# EAGLE design 477part (EAGLE 9.5.1)
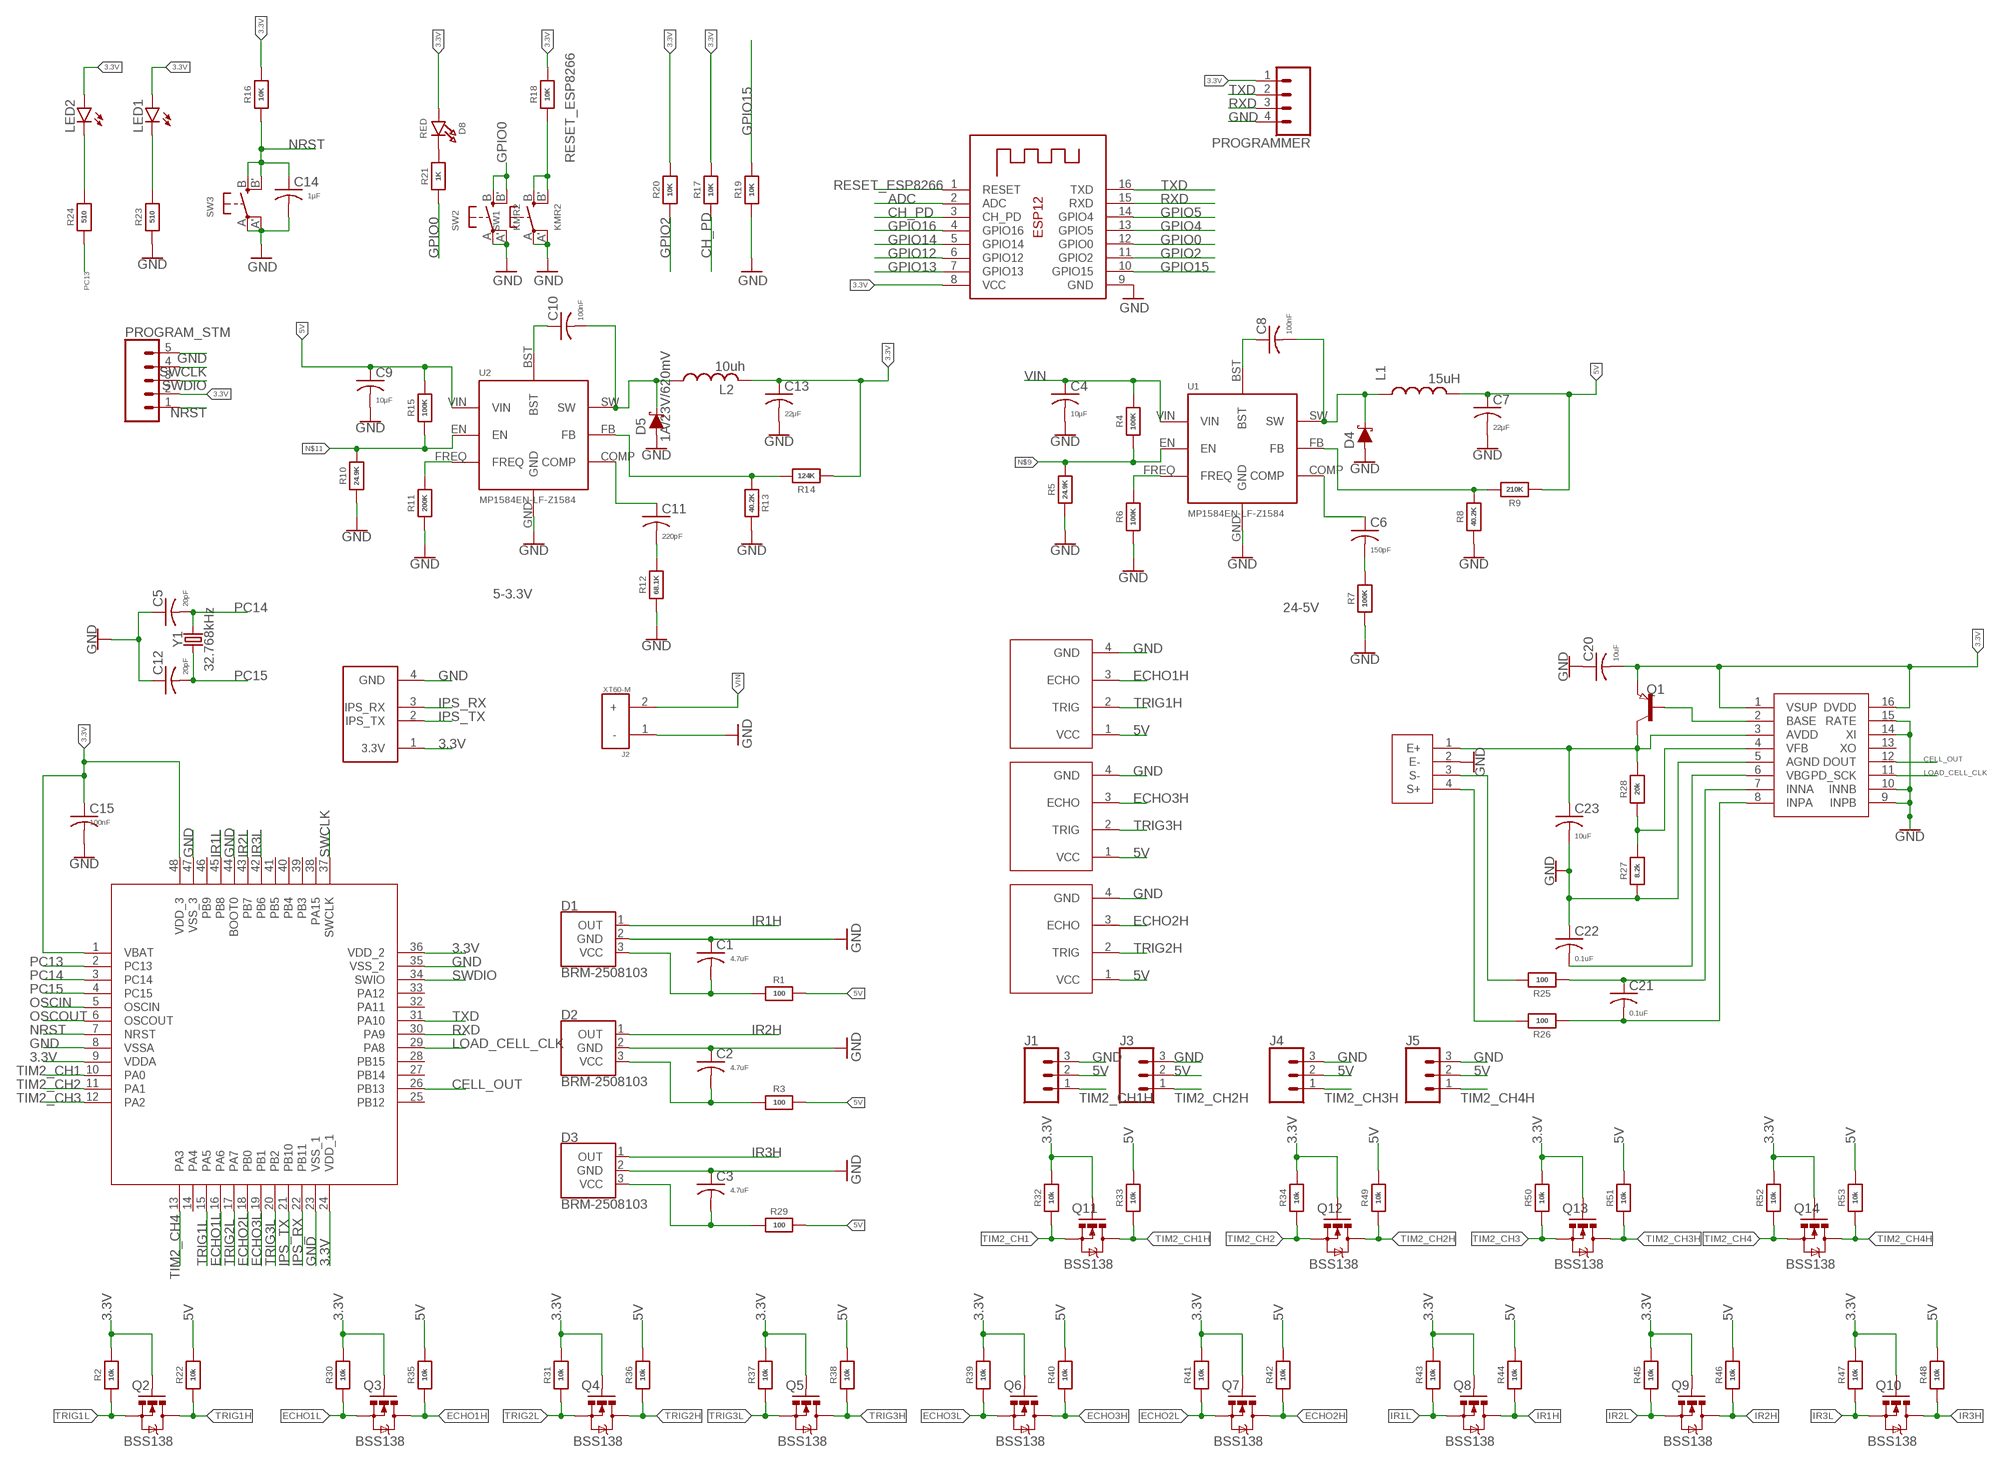
[diagram p0: schematic, sheet 1]

## Parts
C1  4.7uF  C-USC0603  [C0603]
C2  4.7uF  C-USC0603  [C0603]
C3  4.7uF  C-USC0603  [C0603]
C4  10μF  C-USC0603  [C0603]
C5  20pF  C-USC0603  [C0603]
C6  150pF  C-USC0603  [C0603]
C7  22μF  C-USC0603  [C0603]
C8  100nF  C-USC0603  [C0603]
C9  10μF  C-USC0603  [C0603]
C10  100nF  C-USC0603  [C0603]
C11  220pF  C-USC0603  [C0603]
C12  20pF  C-USC0603  [C0603]
C13  22μF  C-USC0603  [C0603]
C14  1µF  C-USC0603  [C0603]
C15  100nF  C-USC0603  [C0603]
C20  10uF  C-USC0603  [C0603]
C21  0.1uF  C-USC0603  [C0603]
C22  0.1uF  C-USC0603  [C0603]
C23  10uF  C-USC0603  [C0603]
D1  BRM-2508103  [1X03]
D2  BRM-2508103  [1X03]
D3  BRM-2508103  [1X03]
D4  1A/23V/620mV  DIODE-SCHOTTKY-BAT20J  [SOD-323]
D5  1A/23V/620mV  DIODE-SCHOTTKY-BAT20J  [SOD-323]
D8  RED  LED0805_NOOUTLINE  [CHIPLED_0805_NOOUTLINE]
ESP8266  ESP-8266  ESP-12  [ESP-12]
HC_SR04_1  ULTRA_4  [1X04]
HC_SR04_2  ULTRA_4  [1X04]
HC_SR04_3  ULTRA_4  [1X04]
J1  CONN_03  [1X03]
J2  XT60-M  [AMASS_XT60-M]
J3  CONN_03  [1X03]
J4  CONN_03  [1X03]
J5  CONN_03  [1X03]
L1  15uH  INDUCTOR2  [INDUCTOR2]
L2  10uh  INDUCTOR  [INDUCTOR]
LED1  LEDCHIP-LED0603  [CHIP-LED0603]
LED2  LEDCHIP-LED0603  [CHIP-LED0603]
PROGRAM_STM  CONN_05  [1X05]
PROGRAMMER  CONN_04  [1X04]
Q1  PNP-TRANSISTOR_SOT23  [SOT23]
Q2  BSS138  MOSFET-NCHANNELSMD  [SOT23-3]
Q3  BSS138  MOSFET-NCHANNELSMD  [SOT23-3]
Q4  BSS138  MOSFET-NCHANNELSMD  [SOT23-3]
Q5  BSS138  MOSFET-NCHANNELSMD  [SOT23-3]
Q6  BSS138  MOSFET-NCHANNELSMD  [SOT23-3]
Q7  BSS138  MOSFET-NCHANNELSMD  [SOT23-3]
Q8  BSS138  MOSFET-NCHANNELSMD  [SOT23-3]
Q9  BSS138  MOSFET-NCHANNELSMD  [SOT23-3]
Q10  BSS138  MOSFET-NCHANNELSMD  [SOT23-3]
Q11  BSS138  MOSFET-NCHANNELSMD  [SOT23-3]
Q12  BSS138  MOSFET-NCHANNELSMD  [SOT23-3]
Q13  BSS138  MOSFET-NCHANNELSMD  [SOT23-3]
Q14  BSS138  MOSFET-NCHANNELSMD  [SOT23-3]
R1  100  RESISTOR0805_NOOUTLINE  [0805-NO]
R2  10k  RESISTOR0805_NOOUTLINE  [0805-NO]
R3  100  RESISTOR0805_NOOUTLINE  [0805-NO]
R4  100K  RESISTOR0805_NOOUTLINE  [0805-NO]
R5  24.9K  RESISTOR0805_NOOUTLINE  [0805-NO]
R6  100K  RESISTOR0805_NOOUTLINE  [0805-NO]
R7  100K  RESISTOR0805_NOOUTLINE  [0805-NO]
R8  40.2K  RESISTOR0805_NOOUTLINE  [0805-NO]
R9  210K  RESISTOR0805_NOOUTLINE  [0805-NO]
R10  24.9K  RESISTOR0805_NOOUTLINE  [0805-NO]
R11  200K  RESISTOR0805_NOOUTLINE  [0805-NO]
R12  68.1K  RESISTOR0805_NOOUTLINE  [0805-NO]
R13  40.2K  RESISTOR0805_NOOUTLINE  [0805-NO]
R14  124K  RESISTOR0805_NOOUTLINE  [0805-NO]
R15  100K  RESISTOR0805_NOOUTLINE  [0805-NO]
R16  10K  RESISTOR0805_NOOUTLINE  [0805-NO]
R17  10K  RESISTOR0805_NOOUTLINE  [0805-NO]
R18  10K  RESISTOR0805_NOOUTLINE  [0805-NO]
R19  10K  RESISTOR0805_NOOUTLINE  [0805-NO]
R20  10K  RESISTOR0805_NOOUTLINE  [0805-NO]
R21  1K  RESISTOR0805_NOOUTLINE  [0805-NO]
R22  10k  RESISTOR0805_NOOUTLINE  [0805-NO]
R23  510  RESISTOR0805_NOOUTLINE  [0805-NO]
R24  510  RESISTOR0805_NOOUTLINE  [0805-NO]
R25  100  RESISTOR0805_NOOUTLINE  [0805-NO]
R26  100  RESISTOR0805_NOOUTLINE  [0805-NO]
R27  8.2k  RESISTOR0805_NOOUTLINE  [0805-NO]
R28  20k  RESISTOR0805_NOOUTLINE  [0805-NO]
R29  100  RESISTOR0805_NOOUTLINE  [0805-NO]
R30  10k  RESISTOR0805_NOOUTLINE  [0805-NO]
R31  10k  RESISTOR0805_NOOUTLINE  [0805-NO]
R32  10k  RESISTOR0805_NOOUTLINE  [0805-NO]
R33  10k  RESISTOR0805_NOOUTLINE  [0805-NO]
R34  10k  RESISTOR0805_NOOUTLINE  [0805-NO]
R35  10k  RESISTOR0805_NOOUTLINE  [0805-NO]
R36  10k  RESISTOR0805_NOOUTLINE  [0805-NO]
R37  10k  RESISTOR0805_NOOUTLINE  [0805-NO]
R38  10k  RESISTOR0805_NOOUTLINE  [0805-NO]
R39  10k  RESISTOR0805_NOOUTLINE  [0805-NO]
R40  10k  RESISTOR0805_NOOUTLINE  [0805-NO]
R41  10k  RESISTOR0805_NOOUTLINE  [0805-NO]
R42  10k  RESISTOR0805_NOOUTLINE  [0805-NO]
R43  10k  RESISTOR0805_NOOUTLINE  [0805-NO]
R44  10k  RESISTOR0805_NOOUTLINE  [0805-NO]
R45  10k  RESISTOR0805_NOOUTLINE  [0805-NO]
R46  10k  RESISTOR0805_NOOUTLINE  [0805-NO]
R47  10k  RESISTOR0805_NOOUTLINE  [0805-NO]
R48  10k  RESISTOR0805_NOOUTLINE  [0805-NO]
R49  10k  RESISTOR0805_NOOUTLINE  [0805-NO]
R50  10k  RESISTOR0805_NOOUTLINE  [0805-NO]
R51  10k  RESISTOR0805_NOOUTLINE  [0805-NO]
R52  10k  RESISTOR0805_NOOUTLINE  [0805-NO]
R53  10k  RESISTOR0805_NOOUTLINE  [0805-NO]
STM32F1  STM32F1LQFP48  [LQFP-48]
SW1  KMR2  SWITCH_TACT_SMT4.6X2.8  [BTN_KMR2_4.6X2.8]
SW2  KMR2  SWITCH_TACT_SMT4.6X2.8  [BTN_KMR2_4.6X2.8]
SW3  KMR2  SWITCH_TACT_SMT4.6X2.8  [BTN_KMR2_4.6X2.8]
U1  MP1584EN-LF-Z1584  [MP1584_V2]
U2  MP1584EN-LF-Z1584  [MP1584_V2]
U$1  IPS_G4  [1X04]
U$9  FSR_SR  [1X04]
U$10  HX711  [SO16A]
Y1  32.768kHz  CRYSTAL-32.768KHZSMD-3.2X1.5  [CRYSTAL-SMD-3.2X1.5MM]

## Nets
3.3V: C13.1 C15.1 C20.2 D8.A ESP8266.8(VCC) L2.P$2 LED1.A LED2.A PROGRAM_STM.2 PROGRAMMER.1 Q1.2(E) Q2.1(G) Q3.1(G) Q4.1(G) Q5.1(G) Q6.1(G) Q7.1(G) Q8.1(G) Q9.1(G) Q10.1(G) Q11.1(G) Q12.1(G) Q13.1(G) Q14.1(G) R2.2 R14.1 R16.2 R17.2 R18.2 R20.2 R30.2 R31.2 R32.2 R34.2 R37.2 R39.2 R41.2 R43.2 R45.2 R47.2 R50.2 R52.2 STM32F1.1(VBAT) STM32F1.9(VDDA) STM32F1.24(VDD_1) STM32F1.36(VDD_2) STM32F1.48(VDD_3) U$1.1(3.3V) U$10.1(VSUP) U$10.16(DVDD)
5V: C7.1 C9.1 HC_SR04_1.1(VCC) HC_SR04_2.1(VCC) HC_SR04_3.1(VCC) J1.2 J3.2 J4.2 J5.2 L1.P$2 R1.2 R3.2 R9.1 R15.2 R22.2 R29.2 R33.2 R35.2 R36.2 R38.2 R40.2 R42.2 R44.2 R46.2 R48.2 R49.2 R51.2 R53.2 U2.VIN
ADC: ESP8266.2(ADC)
BASE: Q1.1(B) U$10.2(BASE)
BST: C8.1 U1.BST
BST@2: C10.1 U2.BST
CELL_OUT [sig]: STM32F1.26(PB13) U$10.12(DOUT)
CH_PD: ESP8266.3(CH_PD) R17.1
COMP: C6.1 U1.COMP
COMP@2: C11.1 U2.COMP
ECHO1H [sig]: HC_SR04_1.3(ECHO) Q3.3(D) R35.1
ECHO1L [sig]: Q3.2(S) R30.1 STM32F1.16(PA6)
ECHO2H [sig]: HC_SR04_3.3(ECHO) Q7.3(D) R42.1
ECHO2L [sig]: Q7.2(S) R41.1 STM32F1.18(PB0)
ECHO3H [sig]: HC_SR04_2.3(ECHO) Q6.3(D) R40.1
ECHO3L [sig]: Q6.2(S) R39.1 STM32F1.19(PB1)
FB: R8.2 R9.2 U1.FB
FB@2: R13.1 R14.2 U2.FB
FREQ: R6.2 U1.FREQ
FREQ@2: R11.2 U2.FREQ
GND: C1.1 C2.1 C3.1 C4.2 C5.1 C7.2 C9.2 C12.1 C13.2 C14.2 C15.2 C20.1 C22.1 C23.2 D1.2(GND) D2.2(GND) D3.2(GND) D4.A D5.A ESP8266.9(GND) HC_SR04_1.4(GND) HC_SR04_2.4(GND) HC_SR04_3.4(GND) J1.3 J2.1(-) J3.3 J4.3 J5.3 PROGRAM_STM.5 PROGRAMMER.4 R5.1 R6.1 R7.1 R8.1 R10.1 R11.1 R12.1 R13.2 R19.1 R23.1 R27.1 STM32F1.8(VSSA) STM32F1.23(VSS_1) STM32F1.35(VSS_2) STM32F1.44(BOOT0) STM32F1.47(VSS_3) SW1.A'(P1) SW1.A(P) SW2.A'(P1) SW2.A(P) SW3.A'(P1) SW3.A(P) U1.GND U2.GND U$1.4(GND) U$9.2(E-) U$10.5(AGND) U$10.9(INPB) U$10.10(INNB) U$10.14(XI) U$10.15(RATE)
GPIO0: ESP8266.12(GPIO0) R21.1 SW2.B'(S1) SW2.B(S)
GPIO2: ESP8266.11(GPIO2) R20.1
GPIO4: ESP8266.13(GPIO5)
GPIO5: ESP8266.14(GPIO4)
GPIO12: ESP8266.6(GPIO12)
GPIO13: ESP8266.7(GPIO13)
GPIO14: ESP8266.5(GPIO14)
GPIO15: ESP8266.10(GPIO15) R19.2
GPIO16: ESP8266.4(GPIO16)
INNA: C21.1 R25.1 U$10.7(INNA)
INPA: C21.2 R26.1 U$10.8(INPA)
IPS_RX [sig]: STM32F1.22(PB11) U$1.3(IPS_RX)
IPS_TX [sig]: STM32F1.21(PB10) U$1.2(IPS_TX)
IR1H: D1.1(OUT) Q8.3(D) R44.1
IR1L: Q8.2(S) R43.1 STM32F1.45(PB8)
IR2H: D2.1(OUT) Q9.3(D) R46.1
IR2L: Q9.2(S) R45.1 STM32F1.43(PB7)
IR3H: D3.1(OUT) Q10.3(D) R48.1
IR3L: Q10.2(S) R47.1 STM32F1.42(PB6)
LOAD_CELL_CLK [sig]: STM32F1.29(PA8) U$10.11(PD_SCK)
N$1: C1.2 D1.3(VCC) R1.1
N$2: C2.2 D2.3(VCC) R3.1
N$3: C11.2 R12.2
N$4: LED2.C R24.2
N$5: C3.2 D3.3(VCC) R29.1
N$6: D8.C R21.2
N$7: R27.2 R28.1 U$10.4(VFB)
N$8: LED1.C R23.2
N$9 [vcc]: R4.1 R5.2 U1.EN
N$10: C6.2 R7.2
N$11: R10.2 R15.1 U2.EN
N$14: C22.2 U$10.6(VBG)
NRST: C14.1 PROGRAM_STM.1 R16.1 STM32F1.7(NRST) SW3.B'(S1) SW3.B(S)
OSCIN: STM32F1.5(OSCIN)
OSCOUT: STM32F1.6(OSCOUT)
PC13: R24.1 STM32F1.2(PC13)
PC14: C5.2 STM32F1.3(PC14) Y1.P$2
PC15: C12.2 STM32F1.4(PC15) Y1.P$1
RESET_ESP8266 [sig]: ESP8266.1(RESET) R18.1 SW1.B'(S1) SW1.B(S)
RXD [sig]: ESP8266.15(RXD) PROGRAMMER.3 STM32F1.30(PA9)
S+: R26.2 U$9.4(S+)
S-: R25.2 U$9.3(S-)
SW [sig]: C8.2 D4.C L1.P$1 U1.SW
SW@2: C10.2 D5.C L2.P$1 U2.SW
SWCLK [sig]: PROGRAM_STM.4 STM32F1.37(SWCLK)
SWDIO [sig]: PROGRAM_STM.3 STM32F1.34(SWIO)
TIM2_CH1: Q11.2(S) R32.1 STM32F1.10(PA0)
TIM2_CH1H: J1.1 Q11.3(D) R33.1
TIM2_CH2: Q12.2(S) R34.1 STM32F1.11(PA1)
TIM2_CH2H: J3.1 Q12.3(D) R49.1
TIM2_CH3: Q13.2(S) R50.1 STM32F1.12(PA2)
TIM2_CH3H: J4.1 Q13.3(D) R51.1
TIM2_CH4: Q14.2(S) R52.1 STM32F1.13(PA3)
TIM2_CH4H: J5.1 Q14.3(D) R53.1
TRIG1H: HC_SR04_1.2(TRIG) Q2.3(D) R22.1
TRIG1L: Q2.2(S) R2.1 STM32F1.15(PA5)
TRIG2H [sig]: HC_SR04_3.2(TRIG) Q4.3(D) R36.1
TRIG2L [sig]: Q4.2(S) R31.1 STM32F1.17(PA7)
TRIG3H [sig]: HC_SR04_2.2(TRIG) Q5.3(D) R38.1
TRIG3L [sig]: Q5.2(S) R37.1 STM32F1.20(PB2)
TXD [sig]: ESP8266.16(TXD) PROGRAMMER.2 STM32F1.31(PA10)
VFB: C23.1 Q1.3(C) R28.2 U$9.1(E+) U$10.3(AVDD)
VIN: C4.1 J2.2(+) R4.2 U1.VIN
Unconnected: STM32F1.14(PA4) STM32F1.25(PB12) STM32F1.27(PB14) STM32F1.28(PB15) STM32F1.32(PA11) STM32F1.33(PA12) STM32F1.38(PA15) STM32F1.39(PB3) STM32F1.40(PB4) STM32F1.41(PB5) STM32F1.46(PB9) U$10.13(XO)

## Notes on the sheet
- 5-3.3V
- 24-5V

## Library data of the parts
C1-C15 C20-C23 = adafruit:C-US: CAPACITOR, American symbol
D1-D3 = BRM-2508:BRM-2508: BRM-2508 IR Receiver Module 2.7V/5.5V IR Receiver with Low Power Consumption, High-immunity Against Ambient Light. Example Datasheet <http://www.sinoskysun.com/upload/20110512/201105120447164615.PDF>
D4 D5 = SparkFun-DiscreteSemi:DIODE-SCHOTTKY: Schottky diode A Schottky diode is a semiconductor diode which has a low forward voltage drop and a very fast switching action.; PROD_ID: DIO-11623
D8 = microbuilder:LED: LED
ESP8266 = microbuilder:ESP-12
HC_SR04_1-HC_SR04_3 = 477pcb:ULTRA_4
J1 J3-J5 = SparkFun-Connectors:CONN_03: Multi connection point. Often used as Generic Header-pin footprint for 0.1 inch spaced/style header connections On any of the 0.1 inch spaced packages, you can populate with these: Break Away Headers - Straight <https://www.sparkfun.com/products/116> (PRT-00116) Break Away Male Headers - Right Angle <https://www.sparkfun.com/products/553> (PRT-00553) Female Headers <https://www.sparkfun.com/products/115> (PRT-00115) Break Away Headers - Machine Pin <https://www.sparkfun.com/products/117> (PRT-00117) Break Away Female Headers - Swiss Machine Pin <https://www.sparkfun.com/products/743> (PRT-00743) Stackable Header - 3 Pin (Female, 0.1") <https://www.sparkfun.com/products/13875> (PRT-13875) For SCREWTERMINALS and SPRING TERMINALS visit here: Screw Terimnals on SparkFun.com <https://www.sparkfun.com/search/results?term=Screw+Terminals> (5mm/3.5mm/2.54mm spacing) This device is also useful as a general connection point to wire up your design to another part of your project. Our various solder wires solder well into these plated through hole pads. Hook-Up Wire - Assortment (Stranded, 22 AWG) <https://www.sparkfun.com/products/11375> (PRT-11375) Hook-Up Wire - Assortment (Solid Core, 22 AWG) <https://www.sparkfun.com/products/11367> (PRT-11367) View the entire wire category on our website here <https://www.sparkfun.com/categories/141> Special notes: Molex polarized connector foot print use with SKU : PRT-08232 with associated crimp pins and housings.
J2 = XT60-M:XT60-M: DC supply; XT60; male; PIN:2; for cable; soldered; 60A; 500V; AVAILABILITY: Unavailable; MF: AMASS; MP: XT60-M; PACKAGE: Package Analog Devices; PRICE: None
L1 = 477pcb:INDUCTOR2
L2 = 477pcb:INDUCTOR
LED1 LED2 = led:LED: LED
PROGRAM_STM = 477pcb:CONN_05: Multi connection point. Often used as Generic Header-pin footprint for 0.1 inch spaced/style header connections On any of the 0.1 inch spaced packages, you can populate with these: Break Away Headers - Straight <https://www.sparkfun.com/products/116> (PRT-00116) Break Away Male Headers - Right Angle <https://www.sparkfun.com/products/553> (PRT-00553) Female Headers <https://www.sparkfun.com/products/115> (PRT-00115) Break Away Headers - Machine Pin <https://www.sparkfun.com/products/117> (PRT-00117) Break Away Female Headers - Swiss Machine Pin <https://www.sparkfun.com/products/743> (PRT-00743) For SCREWTERMINALS and SPRING TERMINALS visit here: Screw Terimnals on SparkFun.com <https://www.sparkfun.com/search/results?term=Screw+Terminals> (5mm/3.5mm/2.54mm spacing) This device is also useful as a general connection point to wire up your design to another part of your project. Our various solder wires solder well into these plated through hole pads. Hook-Up Wire - Assortment (Stranded, 22 AWG) <https://www.sparkfun.com/products/11375> (PRT-11375) Hook-Up Wire - Assortment (Solid Core, 22 AWG) <https://www.sparkfun.com/products/11367> (PRT-11367) View the entire wire category on our website here <https://www.sparkfun.com/categories/141> Special notes: Molex polarized connector foot print use with SKU : PRT-08231 with associated crimp pins and housings. 1MM SMD Version SKU: PRT-10208
PROGRAMMER = SparkFun-Connectors:CONN_04: Multi connection point. Often used as Generic Header-pin footprint for 0.1 inch spaced/style header connections On any of the 0.1 inch spaced packages, you can populate with these: Break Away Headers - Straight <https://www.sparkfun.com/products/116> (PRT-00116) Break Away Male Headers - Right Angle <https://www.sparkfun.com/products/553> (PRT-00553) Female Headers <https://www.sparkfun.com/products/115> (PRT-00115) Break Away Headers - Machine Pin <https://www.sparkfun.com/products/117> (PRT-00117) Break Away Female Headers - Swiss Machine Pin <https://www.sparkfun.com/products/743> (PRT-00743) For SCREWTERMINALS and SPRING TERMINALS visit here: Screw Terimnals on SparkFun.com <https://www.sparkfun.com/search/results?term=Screw+Terminals> (5mm/3.5mm/2.54mm spacing) This device is also useful as a general connection point to wire up your design to another part of your project. Our various solder wires solder well into these plated through hole pads. Hook-Up Wire - Assortment (Stranded, 22 AWG) <https://www.sparkfun.com/products/11375> (PRT-11375) Hook-Up Wire - Assortment (Solid Core, 22 AWG) <https://www.sparkfun.com/products/11367> (PRT-11367) View the entire wire category on our website here <https://www.sparkfun.com/categories/141> Special notes: Molex polarized connector foot print use with SKU : PRT-08231 with associated crimp pins and housings. 1MM SMD Version SKU: PRT-10208; PROD_ID: CONN-09696
Q1 = semicon-smd-ipc:PNP-TRANSISTOR_: PNP TRANSISTOR
Q2-Q14 = SparkFun:MOSFET-NCHANNEL
R1-R53 = microbuilder:RESISTOR: Resistors For new designs, use the packages preceded by an '_' character since they are more reliable: The following footprints should be used on most boards: _0402 - Standard footprint for regular board layouts _0603 - Standard footprint for regular board layouts _0805 - Standard footprint for regular board layouts _1206 - Standard footprint for regular board layouts For extremely tight-pitch boards where space is at a premium, the following 'micro-pitch' footprints can be used (smaller pads, no silkscreen outline, etc.): _0402MP - Micro-pitch footprint for very dense/compact boards _0603MP - Micro-pitch footprint for very dense/compact boards _0805MP - Micro-pitch footprint for very dense/compact boards _1206MP - Micro-pitch footprint for very dense/compact boards
STM32F1 = 477pcb:STM32F1
SW1-SW3 = microbuilder:SWITCH_TACT_SMT: SMT Tact Switches 6x6mm - Digikey: P12940SCT-ND KMR2 (4.6x2.8mm) - Digikey: 401-1426-1-ND EVQ-PQHB55 - Light Touch, 160GF (4.5x4.5mm) - Digikey: P8090SCT-ND KMT0 - KMT021 NGJ LHS (etc.) IP68/Waterproof - Digikey: CKN10289CT-ND
U1 U2 = MP1584EN-LF-Z:MP1584EN-LF-Z: The MP1584 is a high frequency step-down switching regulator with an integrated internal high-side high voltage power MOSFET. It provides 3A output with current mode control for fast loop response and easy compensation. The wide 4.5V to 28V input range accommodates a variety of step-down applications, including those in an automotive input environment. A 100µA operational quiescent current allows use in battery-powered applications.
U$1 = 477pcb:IPS_G
U$9 = 477pcb:FSR_SR
U$10 = 477pcb:HX711
Y1 = SparkFun-Clocks:CRYSTAL-32.768KHZ: 32.768kHz Crystal Frequency: 32.768kHz Frequency Stability: ±20ppm Load Capacitance: 12.5pF (PTH-2X6 & SMD-3.2X1.5), 6pF (SMD-2X6) SparkFun Products: SparkFun BigTime Watch Kit <https://www.sparkfun.com/products/11734> SparkFun nRF52832 Breakout <https://www.sparkfun.com/products/13990> SparkFun Real Time Clock Module <https://www.sparkfun.com/products/12708>; PROD_ID: XTAL-13062

## Net classes
0 default: width 0.152 mm, drill 0.305 mm, clearance 0.254 mm
1 sig: width 0.152 mm, drill 0.305 mm, clearance 0.254 mm
2 vcc: width 0.328 mm, drill 0.305 mm, clearance 0.254 mm

## Board
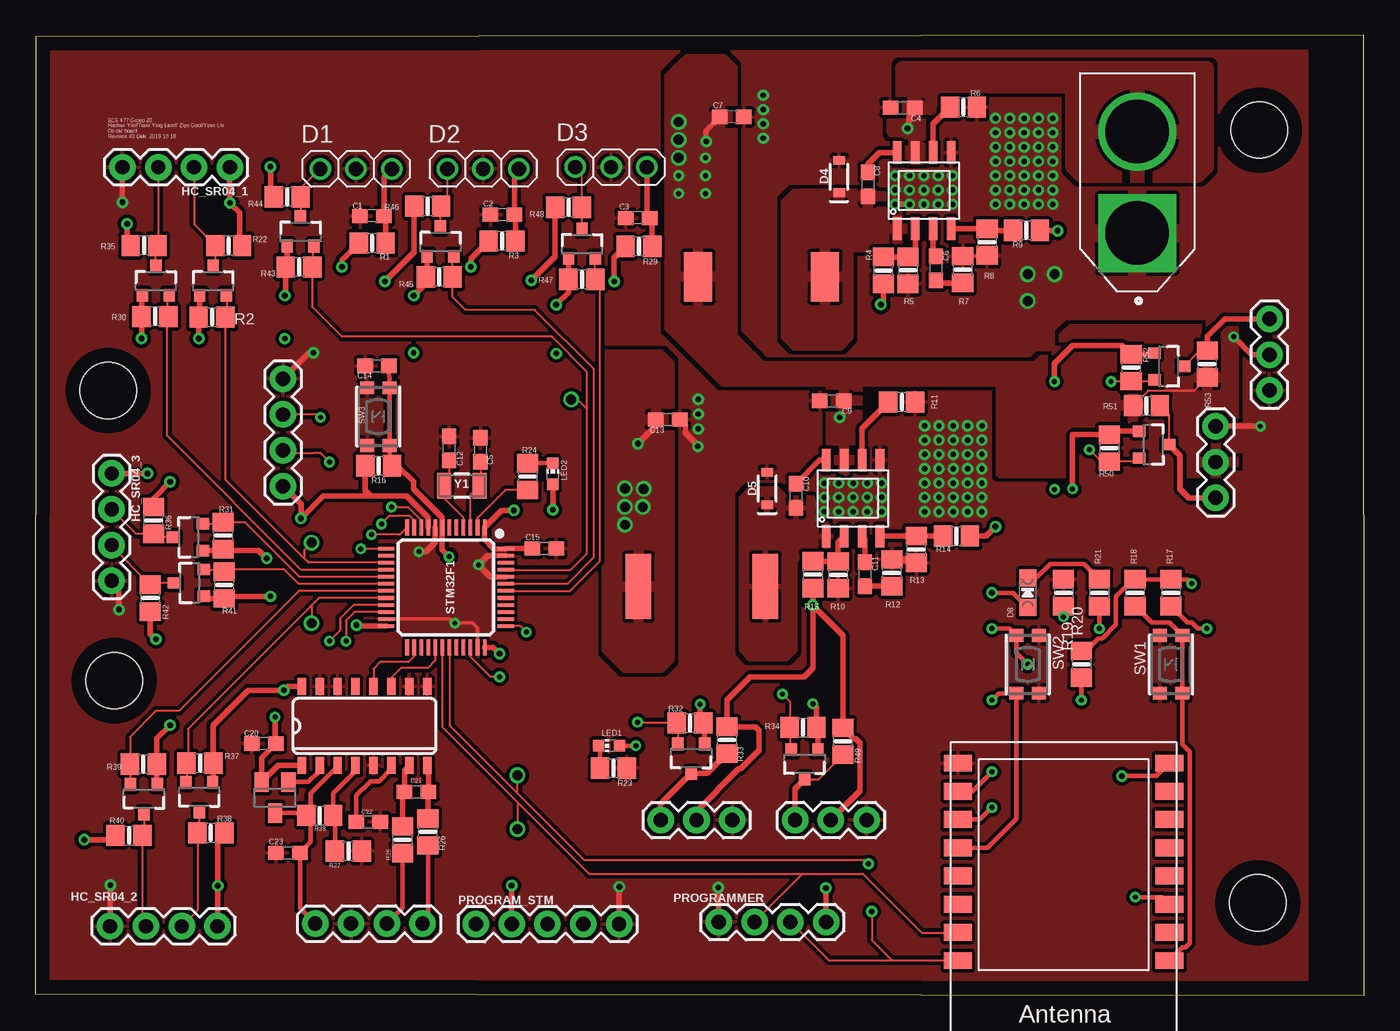
[diagram p1: board, top side]
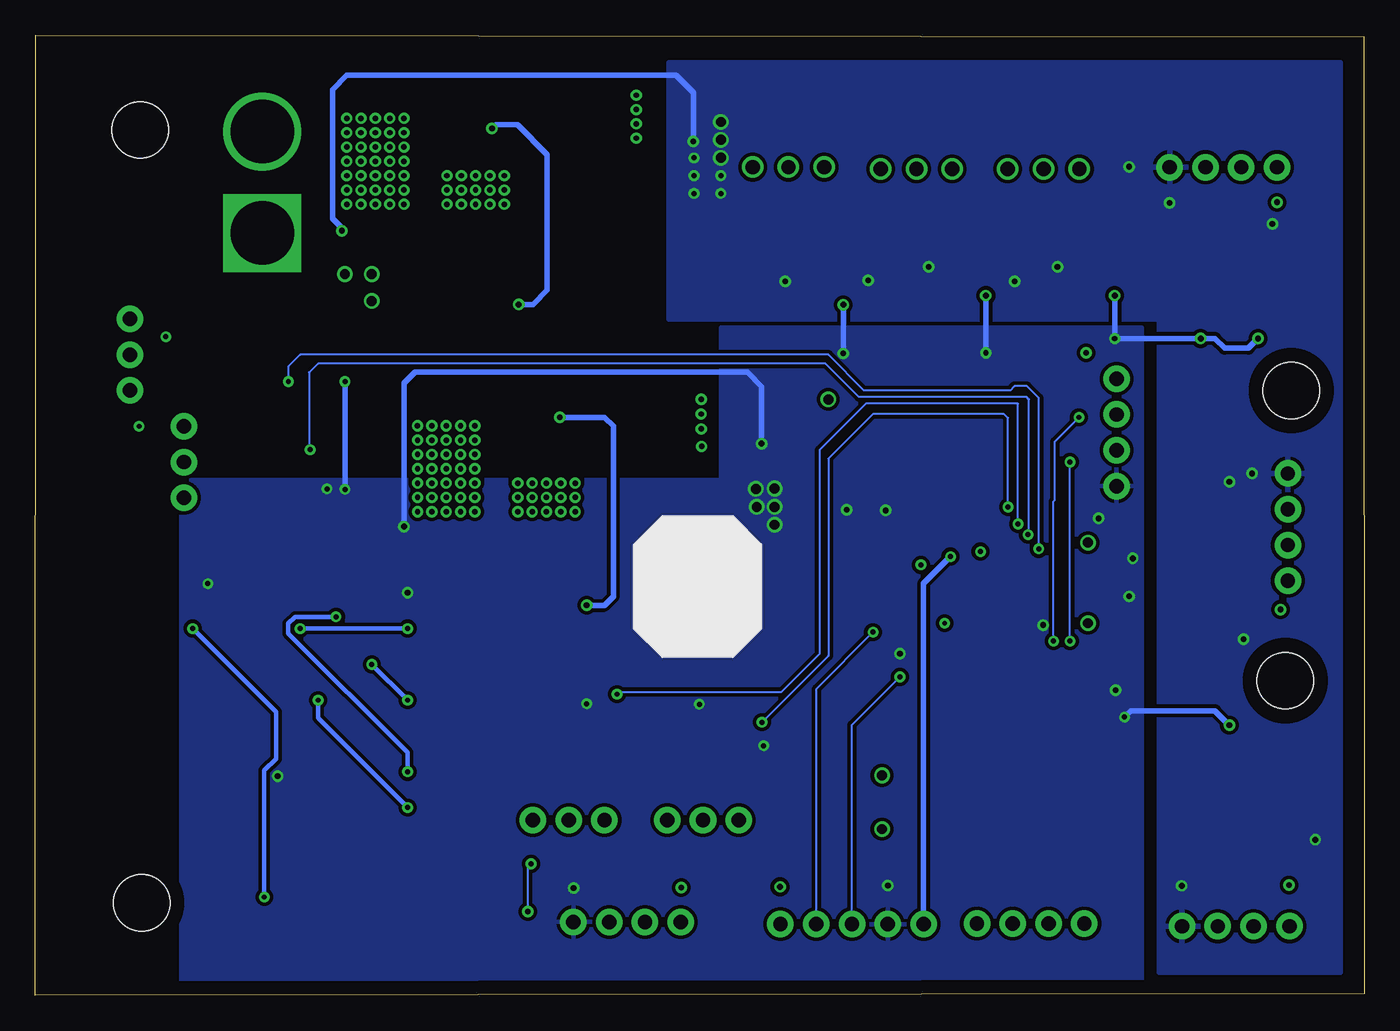
[diagram p2: board, bottom side, seen from below]

Size 94.28 x 68.11 mm. Coordinates in mm from the lower left corner, seen from the top.
Outline: 0,0.11 94.28,0 94.23,68.11 0.03,68.01 0,0.11
Copper layers (1*16): Top 0.035mm / dielectric 1.5mm / Bottom 0.035mm
Design rules "default": minimum track width 6mil, minimum drill 0.35mm, track to track 6mil, track to pad 6mil, pad to pad 6mil, via to via 6mil, smd to smd 6mil, copper to edge 40mil, drill to drill 6mil, minimum pad ring 10mil, minimum via ring 8mil, stop-mask expansion 4mil, vias tented up to drill 0mil, thermal gap 10mil
Holes 4 mm at 86.72,6.57 5.6,22.32 5.17,42.9 86.84,61.39

### Footprints (pad centres in the part's own frame; a part is rotated, then mirrored left to right if it is on the bottom)
C0603 = smd 1.1 x 1: 1 -0.85,0; 2 0.85,0
1X03 = drill 1.016: 1 -2.54,0; 2 0,0; 3 2.54,0
SOD-323 = smd 0.63 x 0.83: A 1.15,0; C -1.15,0
CHIPLED_0805_NOOUTLINE = smd 1.2 x 1.2: A 0,-1.05; C 0,1.05
ESP-12 = smd 2 x 1.2: 1 -7.5,4.5; 2 -7.5,2.5; 3 -7.5,0.5; 4 -7.5,-1.5; 5 -7.5,-3.5; 6 -7.5,-5.5; 7 -7.5,-7.5; 8 -7.5,-9.5; 9 7.5,-9.5; 10 7.5,-7.5; 11 7.5,-5.5; 12 7.5,-3.5; 13 7.5,-1.5; 14 7.5,0.5; 15 7.5,2.5; 16 7.5,4.5
1X04 = drill 1.016 pad 1.88: 1 0,0; 2 2.54,0; 3 5.08,0; 4 7.62,0
1X03' = drill 1.016 pad 1.88: 1 0,0; 2 2.54,0; 3 5.08,0
AMASS_XT60-M = drill 4.5 square: 1 -3.6,0 | drill 4.5: 2 3.6,0
INDUCTOR2 = smd 3.5 x 2: P$1 0,0; P$2 0,9
INDUCTOR = smd 4.6 x 1.8: P$1 0,0; P$2 0,9
CHIP-LED0603 = smd 0.8 x 0.8: A 0,-0.75; C 0,0.75
1X05 = drill 1.016 pad 1.88: 1 0,0; 2 2.54,0; 3 5.08,0; 4 7.62,0; 5 10.16,0
SOT23 = smd 1 x 1.4: 1 -0.95,-1.1; 2 0.95,-1.1; 3 0,1.1
SOT23-3 = smd 0.8 x 0.9: 1 -0.95,-1; 2 0.95,-1; 3 0,1.1
0805-NO = smd 1.3 x 1.5: 1 -0.95,0; 2 0.95,0
LQFP-48 = smd 0.254 x 1.143: 1 -2.75,-4.25; 2 -2.25,-4.25; 3 -1.75,-4.25; 4 -1.25,-4.25; 5 -0.75,-4.25; 6 -0.25,-4.25; 7 0.25,-4.25; 8 0.75,-4.25; 9 1.25,-4.25; 10 1.75,-4.25; 11 2.25,-4.25; 12 2.75,-4.25; 25 2.75,4.25; 26 2.25,4.25; 27 1.75,4.25; 28 1.25,4.25; 29 0.75,4.25; 30 0.25,4.25; 31 -0.25,4.25; 32 -0.75,4.25; 33 -1.25,4.25; 34 -1.75,4.25; 35 -2.25,4.25; 36 -2.75,4.25 | smd 1.143 x 0.254: 13 4.25,-2.75; 14 4.25,-2.25; 15 4.25,-1.75; 16 4.25,-1.25; 17 4.25,-0.75; 18 4.25,-0.25; 19 4.25,0.25; 20 4.25,0.75; 21 4.25,1.25; 22 4.25,1.75; 23 4.25,2.25; 24 4.25,2.75; 37 -4.25,2.75; 38 -4.25,2.25; 39 -4.25,1.75; 40 -4.25,1.25; 41 -4.25,0.75; 42 -4.25,0.25; 43 -4.25,-0.25; 44 -4.25,-0.75; 45 -4.25,-1.25; 46 -4.25,-1.75; 47 -4.25,-2.25; 48 -4.25,-2.75
BTN_KMR2_4.6X2.8 = smd 0.9 x 1: A 2.05,0.8; A' -2.05,0.8; B 2.05,-0.8; B' -2.05,-0.8
MP1584_V2 = smd 1.6 x 0.61: BST 2.7,1.905; COMP -2.7,-0.635; EN -2.7,0.635; FB -2.7,-1.905; FREQ 2.7,-0.635; GND 2.7,-1.905; SW -2.7,1.905; VIN 2.7,0.635
SO16A = smd 0.6 x 1.2: 1 -4.445,-2.8; 2 -3.175,-2.8; 3 -1.905,-2.8; 4 -0.635,-2.8; 5 0.635,-2.8; 6 1.905,-2.8; 7 3.175,-2.8; 8 4.445,-2.8; 9 4.445,2.8; 10 3.175,2.8; 11 1.905,2.8; 12 0.635,2.8; 13 -0.635,2.8; 14 -1.905,2.8; 15 -3.175,2.8; 16 -4.445,2.8
CRYSTAL-SMD-3.2X1.5MM = smd 1 x 1.8: P$1 -1.25,0; P$2 1.25,0

### Placement (x,y rotation side)
C1  23.88,55.29 0 top
C2  33.14,55.37 0 top
C3  42.73,55.15 0 top
C4  61.52,62.96 180 top
C5  31.57,38.69 270 top
C6  63.9,51.57 270 top
C7  49.41,62.32 0 top
C8  59.08,57.54 270 top
C9  56.51,42.18 180 top
C10  53.95,35.43 270 top
C11  58.87,29.88 270 top
C12  29.36,38.8 270 top
C13  44.88,40.85 0 top
C14  24.25,44.66 180 top
C15  36.11,31.69 0 top
C20  16.22,17.86 0 top
C21  27.04,14.45 0 top
C22  23.61,12.32 180 top
C23  17.93,10.12 180 top
D1  22.75,58.64 0 top
D2  31.77,58.64 0 top
D3  40.85,58.76 0 top
D4  57.02,58.08 90 top
D5  51.92,35.96 90 top
D8  70.4,28.56 0 top
ESP8266  72.94,6.97 180 top
HC_SR04_1  13.8,58.75 180 top
HC_SR04_2  12.93,4.9 180 top
HC_SR04_3  5.42,37.02 270 top
J1  [1X03']  44.37,12.43 0 top
J2  78.17,57.68 90 top
J3  [1X03']  53.89,12.43 0 top
J4  [1X03']  83.74,35.29 90 top
J5  [1X03']  87.55,47.99 270 top
L1  56.02,50.98 90 top
L2  51.79,29 90 top
LED1  40.7,17.71 90 top
LED2  36.72,37 0 top
PROGRAM_STM  31.26,5.05 0 top
PROGRAMMER  56.1,5.2 180 top
Q1  17,14.03 180 top
Q2  12.62,50.66 0 top
Q3  8.55,50.66 0 top
Q4  10.89,32.5 90 top
Q5  11.64,14.11 180 top
Q6  7.71,13.96 180 top
Q7  10.96,29.26 90 top
Q8  18.82,54.16 0 top
Q9  28.74,53.44 0 top
Q10  38.79,53.28 0 top
Q11  46.53,16.84 180 top
Q12  54.58,16.43 180 top
Q13  79.31,39.07 270 top
Q14  80.39,44.62 270 top
R1  23.91,53.37 180 top
R2  12.55,48.11 180 top
R3  33.11,53.51 180 top
R4  60.16,51.43 270 top
R5  61.91,51.43 90 top
R6  65.85,63 180 top
R7  65.79,51.49 270 top
R8  67.52,53.43 90 top
R9  70.32,54.27 180 top
R10  56.96,29.83 90 top
R11  61.47,42.09 180 top
R12  60.76,29.97 270 top
R13  62.5,31.64 270 top
R14  65.35,32.58 180 top
R15  55.17,29.84 270 top
R16  24.36,37.57 180 top
R17  80.56,28.56 90 top
R18  78.02,28.56 90 top
R19  72.94,28.56 270 top
R20  74.21,23.48 90 top
R21  75.48,28.56 90 top
R22  13.73,53.19 0 top
R23  41.01,16.12 180 top
R24  34.93,36.8 90 top
R25  26.06,11.04 270 top
R26  27.85,11.59 270 top
R27  22.21,10.24 180 top
R28  20.18,12.76 180 top
R29  42.82,53.14 180 top
R30  8.49,48.16 180 top
R31  13.33,32.61 270 top
R32  46.45,19.32 0 top
R33  49.07,18.11 90 top
R34  54.47,19 0 top
R35  7.72,53.19 180 top
R36  8.4,33.69 90 top
R37  11.69,16.47 0 top
R38  12.46,11.52 0 top
R39  7.67,16.4 0 top
R40  6.65,11.34 180 top
R41  13.4,29.11 270 top
R42  8.17,28.18 270 top
R43  18.71,51.67 180 top
R44  17.88,56.64 180 top
R45  28.65,50.97 180 top
R46  27.84,55.98 180 top
R47  38.77,50.8 180 top
R48  37.83,55.9 180 top
R49  57.29,18.02 90 top
R50  76.19,38.82 90 top
R51  78.82,41.84 180 top
R52  77.74,44.53 90 top
R53  83.13,44.79 270 top
STM32F1  29.13,28.94 180 top
SW1  80.56,23.48 90 top
SW2  70.4,23.48 270 top
SW3  24.34,41.06 90 top
U1  63.06,57.09 90 top
U2  58.02,35.26 90 top
U$1  17.58,36.13 90 top
U$9  19.86,5.08 0 top
U$10  23.35,19.11 0 top
Y1  30.26,36.15 0 top

### Tracks (layer width: path | path; a pad name or v marks a point on that pad's centre or on a via)
3.3V  (via drill 0.35, 0.38, 0.4, 0.41, 0.7)
  Top 0.328: R20.2 74.53,24.43 75.43,25.33 75.69,25.33 76.67,26.31 76.67,28.28 77.9,29.51 R18.2 R17.2 81.74,29.51 v82.04,29.21 | ESP8266.8 79.53,15.56 v77.08,15.56 | D8.A 69.35,28.56 v67.86,28.56 | C20.2 17,17.92 | LED1.A v42.61,17.71
  Top 0.406: U$10.1 17.23,16.31 Q1.2 16.05,16.84 C20.2 | 17,17.92 v17,19.74 | v36.71,34.44 v36.72,34.46 LED2.A | PROGRAM_STM.2 v33.8,7.78 v33.79,7.78 | v56.09,7.61 56.1,7.59 PROGRAMMER.1 | C15.1 STM32F1.48 33.36,31.67 32.53,31.67 31.88,32.33 STM32F1.1 33.09,34.4 v33.95,34.4 | STM32F1.9 27.86,33.21 27.86,33.91 26.35,35.42 23.79,35.42 | 23.79,35.42 23.41,35.8 R16.2 | STM32F1.24 22.86,26.19 v22.78,26.27 | U$1.1 18.85,34.86 v18.85,33.83 20.43,35.42 23.79,35.42 | Q5.1 12.49,15.21 12.64,15.35 R37.2 12.62,16.49 12.62,19.16 15.1,21.65 v17.64,21.65 17.9,21.91 U$10.16 | Q3.1 7.54,49.6 R30.2 v7.54,46.59 | v11.6,46.59 R2.2 11.67,48.18 Q2.1 | v16.42,31 15.86,31.55 13.44,31.55 R31.2 13.23,31.55 Q4.1 | Q7.1 12.11,28.16 R41.2 13.55,28.31 v16.68,28.31 | Q6.1 8.62,15 R39.2 8.62,18.22 v9.57,19.16 | Q8.1 17.87,51.78 R43.2 17.76,49.71 v17.7,49.64 | Q9.1 27.79,51.06 R45.2 27.7,50.51 v26.84,49.64 | Q10.1 37.84,50.81 R47.2 37.82,49.87 v36.95,49 | R14.1 67.44,32.58 v68.12,33.26 | v42.75,39.14 44.03,40.42 C13.1 | STM32F1.36 32.49,24.69 v32.94,24.24 | Q11.1 47.48,19.23 R32.2 47.17,19.55 v47.17,20.65 | Q12.1 55.53,18.89 R34.2 55.42,20.43 v55.16,20.69 | Q13.1 76.44,40.02 R50.2 73.61,39.77 73.58,39.74 v73.58,35.93 | Q14.1 79.31,45.48 R52.2 77.13,46.09 73.58,46.09 72.31,44.82 v72.31,43.55
  Bottom 0.406: v7.54,46.59 8.22,45.92 9.91,45.92 10.59,46.59 v11.6,46.59 v17.7,46.59 v17.7,49.64 | v9.57,19.16 10.59,20.18 16.57,20.18 v17,19.74 | v68.12,33.26 68.12,43.42 67.31,44.22 43.77,44.22 42.75,43.21 v42.75,39.14 | v36.95,49 36.95,45.55 v36.96,45.54 | v26.84,49.64 v26.84,45.58 | v72.31,43.55 v72.31,35.9
  other vias: 41.83,35.96 43.16,35.93 43.1,34.66 41.83,34.66 41.83,33.39
  pour Bottom: 15.79,47.36 15.79,0.62 83.91,0.62 83.91,36.57 45.64,36.57 45.64,47.36
  pour Top (rank 5): 45,23.86 45,44.82 44.37,45.45 40.56,45.45 40.56,24.5 41.83,23.23 44.37,23.23
5V  (via drill 0.35, 0.41, 0.7)
  Top 0.152: R51.2 78.95,42.92 81.83,42.92 81.83,42.91 82.21,42.91 R53.2
  Top 0.406: HC_SR04_2.1 12.93,7.75 v12.94,7.77 12.94,11.05 R38.2 | HC_SR04_3.1 v7.96,37.02 | HC_SR04_1.1 v13.8,56.21 14.5,55.52 14.5,53.37 R22.2 | R35.2 6.52,53.44 v6.52,54.72 | R42.2 8.17,25.65 v8.55,25.26 | R36.2 8.39,35.26 v9.57,36.43 | R40.2 5.39,11.03 v3.47,11.03 | R44.2 16.68,56.89 v16.68,58.79 | R1.2 21.76,52.17 v21.76,51.67 | R46.2 26.89,52.74 v24.81,50.66 | R3.2 30.91,52.26 v30.91,51.67 | R29.2 41.07,52.33 v41.07,50.66 | R48.2 36.88,52.41 v35.2,50.72 | R9.1 72.5,54.27 v72.52,54.25 | v47.59,60.58 47.59,61.34 C7.1 | R15.2 55.17,27.68 v55.16,27.67 | v55.16,27.67 57.29,25.55 R49.2 58.08,18.18 58.23,18.18 58.49,17.91 58.49,14.49 J3.2 | v55.16,27.67 55.16,23.23 54.53,22.59 50.72,22.59 49.07,20.95 R33.2 51.08,19.06 51.35,18.78 51.35,17.39 50.01,16.05 49.89,16.05 46.91,13.07 J1.2 | J5.2 86.28,45.45 v85.01,46.72
  Bottom 0.406: v72.52,54.25 72.52,54.43 73.2,55.1 73.2,64.25 72.18,65.26 48.81,65.26 47.59,64.04 v47.59,60.58 | v55.16,27.67 53.89,27.67 53.26,28.31 53.26,40.37 53.89,41.01 v57.07,41.01
  other vias: 45.64,61.96 45.64,60.69 45.64,59.42 47.54,59.42 47.54,58.15 47.54,56.88 45.64,56.88 45.64,58.15
  pour Bottom: 49.32,66.15 49.32,47.99 14.52,47.99 14.52,1.64 1.7,1.64 1.7,66.15
  pour Top: 58.34,37.2 56.43,37.2 56.43,43.55 48.81,43.55 45,47.36 45,65.16 45.97,66.12 48.85,66.12 49.45,65.53 49.45,46.71 51.54,44.62 84.91,44.62 84.91,37.06 68.5,37.06 68.5,43.55 58.34,43.55
  pour Top: 46.27,66.41 48.81,66.41 49.45,65.77 49.45,46.72 51.52,44.65 70.98,44.65 72.94,46.61 72.94,46.72 73.5,47.28 85.01,47.28 85.01,37.2 68.5,37.2 68.5,43.55 58.34,43.55 58.34,37.2 56.43,37.2 56.43,43.55 48.81,43.55 45,47.36 45,65.14
BASE
  Top 0.328: U$10.2 20.18,15.93 19.37,15.13 Q1.1
BST
  Top 0.406: U1.BST 59.89,59.79 59.08,58.98 C8.1
BST@2
  Top 0.406: U2.BST 55.64,37.96 C10.1
CELL_OUT
  Top 0.152: STM32F1.26 26.88,24.05 26.47,23.64 24.46,23.64 23.99,23.17 U$10.12
CH_PD  (via drill 0.35)
  Top 0.305: ESP8266.3 79.94,6.97 v78.02,6.97 | R17.1 81.74,26.44 82.05,26.44 82.47,26.02 v83.1,26.02
  Bottom 0.305: v78.02,6.97 78.02,15.95 77.19,16.78 77.19,20.11 v83.1,26.02
COMP
  Top 0.406: U1.COMP 63.69,52.63 C6.1
COMP@2
  Top 0.406: U2.COMP 58.87,32.35 C11.1
ECHO1H
  Top 0.152: Q3.3 8.55,53.08 R35.1 8.72,53.25 HC_SR04_1.3
ECHO1L
  Top 0.152: STM32F1.16 18.86,30.19 9.36,39.7 9.36,48.08 R30.1 9.36,48.25 9.36,49.51 Q3.2
ECHO2H
  Top 0.152: Q7.3 8.3,29.26 R42.1 5.42,31.87 HC_SR04_3.3
ECHO2L
  Top 0.152: STM32F1.18 18.69,29.19 17.62,30.26 13.61,30.26 R41.1 13.25,30.21 Q7.2
ECHO3H
  Top 0.152: Q6.3 7.71,11.46 R40.1 7.6,5.15 HC_SR04_2.3
ECHO3L
  Top 0.152: STM32F1.19 18.72,28.69 10.2,20.18 8.55,20.18 6.72,18.35 R39.1 6.72,15 Q6.2
FB
  Top 0.406: R9.2 67.64,54.27 R8.2 64.97,54.38 U1.FB
FB@2
  Top 0.406: R14.2 64.39,32.59 R13.1 59.95,32.59 U2.FB
FREQ
  Top 0.406: U1.FREQ 63.69,61.8 R6.2
FREQ@2
  Top 0.406: U2.FREQ 58.65,40.23 R11.2
GND  (via drill 0.35, 0.38, 0.41, 0.7)
  Top 0.254: R7.1 67.48,52.44 R8.1 | STM32F1.35 31.38,26.06 31.03,26.4 v29.76,26.4 29.47,26.69 STM32F1.23
  Top 0.406: PROGRAM_STM.5 41.42,7.67 v41.44,7.7 | v48.45,7.64 48.48,7.61 PROGRAMMER.4 | HC_SR04_2.4 5.31,7.78 v5.34,7.81 | HC_SR04_3.4 5.93,28.9 v5.93,27.37 | HC_SR04_1.4 v6.18,56.27 v6.19,56.27 | U$1.4 19.41,45.58 v19.73,45.58 | C13.2 46.12,40.46 46.12,39.88 47,39 v47,38.94 | v61,56.12 v62.02,56.12 | v27.22,31.48 27.74,31.48 28.38,32.12 STM32F1.8 | STM32F1.44 32.3,29.69 v31.45,30.54 32.11,31.19 STM32F1.47 | J4.3 v86.91,40.37
  Top 0.508: R12.1 62.26,30.92 R13.2
  other vias: 72.18,56.12 71.16,56.12 70.15,56.12 68.12,62.22 51.64,63.86 51.64,62.84 51.64,61.83 51.64,60.81 69.13,62.22 70.15,62.22 71.16,62.22 65.12,35.32 72.31,51.17 70.4,51.17 70.4,49.26 68.12,56.12 69.13,56.12 68.12,57.14 69.13,57.14 70.15,57.14 71.16,57.14 72.18,57.14 72.18,58.15 71.16,58.15 70.15,58.15 69.13,58.15 68.12,58.15 68.12,59.17 69.13,59.17 70.15,59.17 71.16,59.17 72.18,59.17 72.18,60.18 71.16,60.18 72.18,62.22 72.18,61.2 71.16,61.2 70.15,60.18 70.15,61.2 69.13,60.18 69.13,61.2 68.12,60.18 68.12,61.2 65.07,56.12 65.07,58.15 65.07,57.14 64.05,58.15 64.05,57.14 63.04,58.15 62.02,58.15 61,58.15 61,57.14 62.02,57.14 63.04,56.12 64.05,56.12 63.04,57.14 55.98,36.34 56.99,36.34 58.01,36.34 59.03,36.34 60.04,36.34 55.98,35.32 56.99,35.32 58.01,35.32 59.03,35.32 60.04,35.32 60.04,34.31 59.03,34.31 58.01,34.31 56.99,34.31 55.98,34.31 63.09,34.31 63.09,40.4 64.11,40.4 65.12,40.4 67.15,34.31 66.14,34.31 65.12,34.31 64.11,34.31 63.09,35.32 64.11,35.32 66.14,35.32 67.15,35.32 63.09,36.34 64.11,36.34 65.12,36.34 66.14,36.34 67.15,36.34 67.15,37.36 66.14,37.36 65.12,37.36 64.11,37.36 63.09,37.36 63.09,38.37 64.11,38.37 63.09,39.39 64.11,39.39 65.12,39.39 65.12,38.37 66.14,38.37 66.14,39.39 66.14,40.4 67.15,39.39 67.15,38.37 47.03,40.18 47.04,41.24 47.03,42.29 67.16,40.4
  pour Top (rank 6): 0.41,67.95 0.41,-0.01 90.21,-0.01 90.21,67.95
  pour Top (rank 5): 74.21,55.95 74.21,49.9 73.58,49.26 85.01,49.26 85.01,55.61 83.77,56.85 75.11,56.85
GPIO0  (via drill 0.35)
  Top 0.305: ESP8266.12 67.55,10.47 69.6,12.52 SW2.B 68.35,21.43 v67.86,20.94 | R21.1 v75.48,26.02 | v67.86,26.02 69.11,26.02 SW2.B'
  Top 0.328: v70.4,23.48 69.6,24.28 SW2.B'
  Bottom 0.305: v75.48,26.02 v67.86,26.02 | v70.4,23.48 v67.86,20.94
GPIO2  (via drill 0.35)
  Top 0.305: R20.1 v74.21,20.94 | v67.86,13.32 67.01,12.47 ESP8266.11
  Bottom 0.305: v74.21,20.94 74.21,19.67 v67.86,13.32
GPIO15  (via drill 0.35)
  Top 0.305: R19.2 v72.94,26.86 | v67.86,15.86 66.47,14.47 ESP8266.10
  Bottom 0.305: v72.94,26.86 75.83,26.86 76.32,26.37 76.32,25.67 67.86,17.22 v67.86,15.86
INNA
  Top 0.406: R25.1 26.06,14.32 C21.1 26.19,15.97 U$10.7
INPA
  Top 0.406: U$10.8 27.89,16.22 C21.2 27.85,14.41 R26.1
IPS_RX  (via drill 0.35)
  Top 0.152: v22.04,25.13 22.04,26.58 22.65,27.19 STM32F1.22 | v20.24,41.01 20.04,41.21 U$1.3
  Bottom 0.152: v22.04,25.13 22.04,35.05 21.96,35.13 21.96,39.28 v20.24,41.01
IPS_TX  (via drill 0.35)
  Top 0.152: U$1.2 17.78,38.47 19.6,38.47 19.73,38.47 20.24,38.47 v20.87,37.83 | v20.87,25.13 21.63,25.89 21.63,26.75 22.58,27.69 STM32F1.21
  Bottom 0.152: v20.87,25.13 v20.87,37.83
IR1H
  Top 0.152: D1.1 18.83,57.25 R44.1 Q8.3
IR1L  (via drill 0.7)
  Top 0.152: 39.12,41.64 39.12,44.26 36.66,46.72 21.76,46.72 19.66,48.82 R43.1 19.66,53.05 Q8.2 | 39.12,41.64 39.12,31.31 37.99,30.18 37.98,30.19 STM32F1.45 | 39.12,41.64 38.48,42.28 v38.02,42.28
IR2H
  Top 0.152: Q9.3 28.74,55.93 R46.1 29.23,56.42 D2.1
IR2L
  Top 0.152: STM32F1.43 37.74,29.19 39.6,31.05 39.6,44.46 35.43,48.63 30.52,48.63 29.6,49.55 R45.1 29.6,52.35 Q9.2
IR3H
  Top 0.152: Q10.3 R48.1 38.78,58.28 D3.1
IR3L
  Top 0.152: STM32F1.42 37.92,28.69 40.05,30.82 40.05,50.47 R47.1 39.72,52.27 Q10.2
LOAD_CELL_CLK
  Top 0.152: STM32F1.29 28.38,23.75 27.86,23.23 25.95,23.23 25.26,22.53 U$10.11
N$1
  Top 0.406: R1.1 24.86,55.17 C1.2 24.73,58.08 D1.3
N$2
  Top 0.328: 34.06,55.3 C2.2
  Top 0.406: R3.1 34.06,55.3 | C2.2 33.99,58.32 D2.3
N$3
  Top 0.406: C11.2 60.75,29.03 R12.2
N$4
  Top 0.328: R24.2 36.19,37.75 LED2.C
N$5
  Top 0.406: D3.3 43.39,55.34 C3.2 43.77,54.96 R29.1
N$6
  Top 0.305: D8.C 71,29.61 72,30.62 74.38,30.62 R21.2
N$7
  Top 0.328: R27.2 21.26,12.62 R28.1 21.13,14.34 22.72,15.93 U$10.4
N$8
  Top 0.328: R23.2 40.06,17.6 LED1.C
N$9
  Top 0.406: R4.1 R5.2 62.42,52.89 U1.EN
N$10
  Top 0.406: R7.2 64.08,50.54 C6.2
N$11
  Top 0.406: R15.1 56.94,30.79 R10.2 56.96,32.14 U2.EN
N$14
  Top 0.328: C22.2 22.76,14.18 23.78,15.19 24.39,15.19 25.28,16.09 25.28,16.29 U$10.6
NRST  (via drill 0.35)
  Top 0.328: R16.1 25.14,37.74 SW3.B' SW3.B 25.15,43.12 C14.1
  Top 0.406: R16.1 25.71,37.56 26.84,36.43 26.84,35.93 28.86,33.91 28.86,33.21 STM32F1.7 28.88,31.59 v29.35,31.12
  Bottom 0.406: v29.35,31.12 31.26,29.21 PROGRAM_STM.1
PC13
  Top 0.152: R24.1 33.36,35.85 31.38,33.87 STM32F1.2
PC14
  Top 0.152: STM32F1.3 30.88,35.52 Y1.P$2 31.57,36.21 C5.2
PC15
  Top 0.152: STM32F1.4 30.38,33.91 29.01,35.28 Y1.P$1 29.36,36.5 C12.2
RESET_ESP8266
  Top 0.305: R18.1 79.2,26.44 80.45,26.44 SW1.B SW1.B' 81.36,17.8 81.9,17.26 81.9,3.68 81.63,3.41 81.39,3.41 ESP8266.1
RXD  (via drill 0.7)
  Top 0.152: STM32F1.30 28.88,19.03 34.21,13.7 | 34.21,13.7 39.29,8.62 54.44,8.62 | 54.44,8.62 PROGRAMMER.3 | 54.44,8.62 58.72,8.62 62.91,4.43 65.4,4.43 ESP8266.15 | 34.21,13.7 v34.21,11.8
S+
  Top 0.328: R26.2 27.85,5.46 U$9.4
S-
  Top 0.328: U$9.3 26.06,6.2 R25.2
SW
  pour Top (rank 2): 62.06,55.36 62.06,53.07 57.7,53.07 57.7,46.72 57.07,46.09 53.89,46.09 53.26,46.72 53.26,56.25 53.89,56.88 60.24,56.88 60.24,55.36
SW@2
  pour Top (rank 4): 56.43,33.39 56.43,31.48 54.53,31.48 53.89,30.85 53.89,24.5 53.26,23.86 50.72,23.86 50.08,24.5 50.08,35.29 50.72,35.93 52.62,35.93 53.26,35.29 55.16,35.29 55.16,33.39
SWCLK  (via drill 0.35)
  Top 0.152: v34.84,25.77 34.42,26.19 STM32F1.37
  Bottom 0.152: PROGRAM_STM.4 38.88,21.73 v34.84,25.77
SWDIO  (via drill 0.35)
  Top 0.152: v32.94,22.59 32.3,22.59 30.88,24.02 STM32F1.34
  Bottom 0.152: PROGRAM_STM.3 36.34,19.19 v32.94,22.59
TIM2_CH1  (via drill 0.35)
  Top 0.152: v25.27,34.65 25.32,34.6 26.5,34.6 27.38,33.72 STM32F1.10 | v42.72,19.38 45.44,19.38 R32.1 45.58,19.23 Q11.2
  Bottom 0.152: v25.27,34.65 25.27,40.96 25.57,41.25 34.84,41.25 38.02,38.08 38.02,24.08 v42.72,19.38
TIM2_CH1H
  Top 0.406: R33.1 47.65,15.74 Q11.3 44.37,13.57 J1.1
TIM2_CH2  (via drill 0.35)
  Top 0.152: STM32F1.11 26.87,33.72 26.6,33.99 25.11,33.99 v24.56,33.44 | Q12.2 53.52,17.54 53.52,18.78 R34.1 53.52,20.85 v53.01,21.36
  Bottom 0.152: v24.56,33.44 24.56,41.98 35.36,41.98 38.64,38.69 38.64,24.22 41.35,21.51 52.86,21.51 v53.01,21.36
TIM2_CH2H
  Top 0.152: Q12.3 55.55,15.33 R49.1
  Top 0.406: Q12.3 53.89,14.64 J3.1
TIM2_CH3  (via drill 0.35)
  Top 0.152: STM32F1.12 25.87,32.68 v23.85,32.68 | v74.77,38.71 75.62,37.87 R50.1 78.06,37.87 Q13.2
  Bottom 0.152: v23.85,32.68 23.77,32.76 23.77,42.28 23.95,42.45 35.84,42.45 38.2,44.82 74.21,44.82 74.85,44.18 74.85,38.78 v74.77,38.71
TIM2_CH3H
  Top 0.152: R51.1 80.41,41.2 Q13.3
  Top 0.406: Q13.3 81.2,38.28 81.2,35.93 81.83,35.29 J4.1
TIM2_CH4  (via drill 0.35)
  Top 0.152: STM32F1.13 24.86,31.67 v23.09,31.67 | v76.32,43.55 76.35,43.58 R52.1 79.31,43.58 Q14.2
  Bottom 0.152: v23.09,31.67 23.09,42.39 23.92,43.22 24.81,43.22 25.11,42.91 35.48,42.91 38.02,45.45 75.48,45.45 76.32,44.62 v76.32,43.55
TIM2_CH4H
  Top 0.152: Q14.3 82.61,45.74 R53.1
  Top 0.406: R53.1 83.13,46.75 84.37,47.99 J5.1
TRIG1H
  Top 0.152: HC_SR04_1.2 11.26,54.71 R22.1 12.78,51.92 Q2.3
TRIG1L  (via drill 0.7)
  Top 0.152: STM32F1.15 19.38,30.69 19.09,30.97 | 19.09,30.97 13.5,36.57 R2.1 13.57,48.18 Q2.2 | 19.09,30.97 19.09,31.61 v19.6,32.12
TRIG2H
  Top 0.152: Q4.3 8.63,32.5 R36.1 7.17,32.74 HC_SR04_3.2
TRIG2L
  Top 0.152: STM32F1.17 18.76,29.69 14.9,33.56 R31.1 13.23,33.45 Q4.2
TRIG3H
  Top 0.152: Q5.3 11.64,11.65 R38.1 11.51,6.02 HC_SR04_2.2
TRIG3L  (via drill 0.7)
  Top 0.152: STM32F1.20 20.12,28.19 19.6,27.67 | 19.6,27.67 10.84,18.91 10.84,16.58 R37.1 10.74,15.15 Q5.2 | 19.6,27.67 v19.6,26.4
TXD  (via drill 0.35, 0.41, 0.7)
  Top 0.152: STM32F1.31 29.38,19.17 34.21,14.34 | 34.21,14.34 38.96,9.59 58.84,9.59 v59.1,9.33 | 60.78,2.47 59.34,3.91 v59.34,5.94 | 60.78,2.47 ESP8266.16 | PROGRAMMER.2 56.3,2.47 60.78,2.47 | 34.21,14.34 v34.21,15.61
  Bottom 0.152: v59.1,9.33 59.34,9.09 v59.34,5.94
VFB
  Top 0.328: U$9.1 18.78,6.16 C23.1 19.54,10.88 19.54,12.44 R28.2 | R28.2 19.54,13.07 19.54,14.33 21.45,16.23 U$10.3 | Q1.3 19.06,12.93 R28.2
VIN  (via drill 0.41)
  Top 0.406: R4.2 60.16,49.18 v59.99,49.01 | v61.88,61.5 61.98,61.61 61.98,62.39 62.37,62.78 C4.1
  Bottom 0.406: v59.99,49.01 58.97,49.01 57.96,50.02 57.96,59.65 60.08,61.77 61.6,61.77 v61.88,61.5
  pour Top: 62.78,59.42 62.15,59.42 62.15,60.69 61.51,60.69 60.88,61.33 60.88,61.96 61.51,62.6 61.51,65.77 83.1,65.77 83.1,58.79 82.47,58.15 74.21,58.15 73.58,58.79 73.58,64.5 64.69,64.5 63.42,63.23 63.42,61.96 62.78,61.33

### Text on the board
tNames: ECE 477 Group 20 / Haotian Yin//Tsam Ying Lam// Ziyu Guo//Yuan Liu / On-car board / Revision #3 Date: 2019.10.18